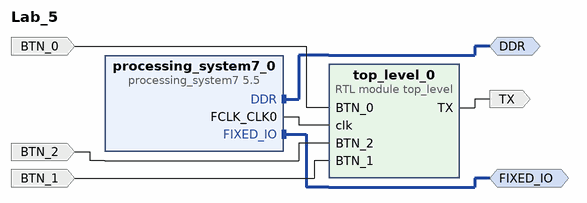
[diagram p0: block diagram of the top level]
# Vivado block design Lab_5, xc7z010clg225-1, Vivado 2019.1
create_bd_design Lab_5

create_bd_intf_port -mode Master -vlnv xilinx.com:interface:ddrx_rtl:1.0 DDR
create_bd_intf_port -mode Master -vlnv xilinx.com:display_processing_system7:fixedio_rtl:1.0 FIXED_IO
create_bd_port -dir I BTN_0
create_bd_port -dir I BTN_1
create_bd_port -dir I BTN_2
create_bd_port -dir O TX

create_bd_cell -type ip -vlnv xilinx.com:ip:processing_system7:5.5 processing_system7_0
set_property -dict [list \
  CONFIG.PCW_UART1_PERIPHERAL_ENABLE 1 \
  CONFIG.PCW_UART1_UART1_IO {MIO 8 .. 9} \
  CONFIG.PCW_UART_PERIPHERAL_FREQMHZ 100 \
  CONFIG.PCW_USE_M_AXI_GP0 0 \
] [get_bd_cells processing_system7_0]
# 39 more settings of processing_system7_0 are not shown: defaults, MIO pin electricals, DDR timing, and values the tool derives
create_bd_cell -type module -reference top_level top_level_0

# ---- connections ----

connect_bd_intf_net [get_bd_intf_ports DDR] [get_bd_intf_pins processing_system7_0/DDR]
connect_bd_intf_net [get_bd_intf_ports FIXED_IO] [get_bd_intf_pins processing_system7_0/FIXED_IO]
connect_bd_net [get_bd_pins processing_system7_0/FCLK_CLK0] [get_bd_pins top_level_0/clk]
connect_bd_net -net BTN_0_1 [get_bd_ports BTN_0] [get_bd_pins top_level_0/BTN_0]
connect_bd_net -net BTN_2_1 [get_bd_ports BTN_2] [get_bd_pins top_level_0/BTN_2]
connect_bd_net -net BTN_1_1 [get_bd_ports BTN_1] [get_bd_pins top_level_0/BTN_1]
connect_bd_net [get_bd_pins top_level_0/TX] [get_bd_ports TX]

validate_bd_design
save_bd_design
